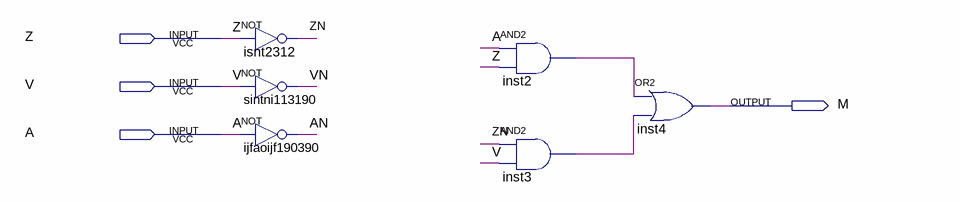
[diagram p0: schematic sheet]
// Quartus schematic mux.bdf as structural Verilog: 6 symbols, 4 pins
module mux (
  input  Z,
  input  V,
  input  A,
  output M
);

  wire AN, inst2_out, inst3_out, VN, ZN;

  not isnt2312 (ZN, Z);
  not sintni113190 (VN, V);
  not ijfaoijf190390 (AN, A);
  and inst2 (inst2_out, A, Z);
  and inst3 (inst3_out, ZN, V);
  or inst4 (M, inst2_out, inst3_out);
endmodule
